# Altium schematic sheet DSO_Control.SchDoc: Schematic_Name
size A4; CompanyName: University of Melbourne; Engineer: Your Name Here; DocumentNumber: 1; Revision: 0.1; SheetNumber: 1; SheetTotal: 1; Title_Project: Project_Title; StudentNo: Student No.
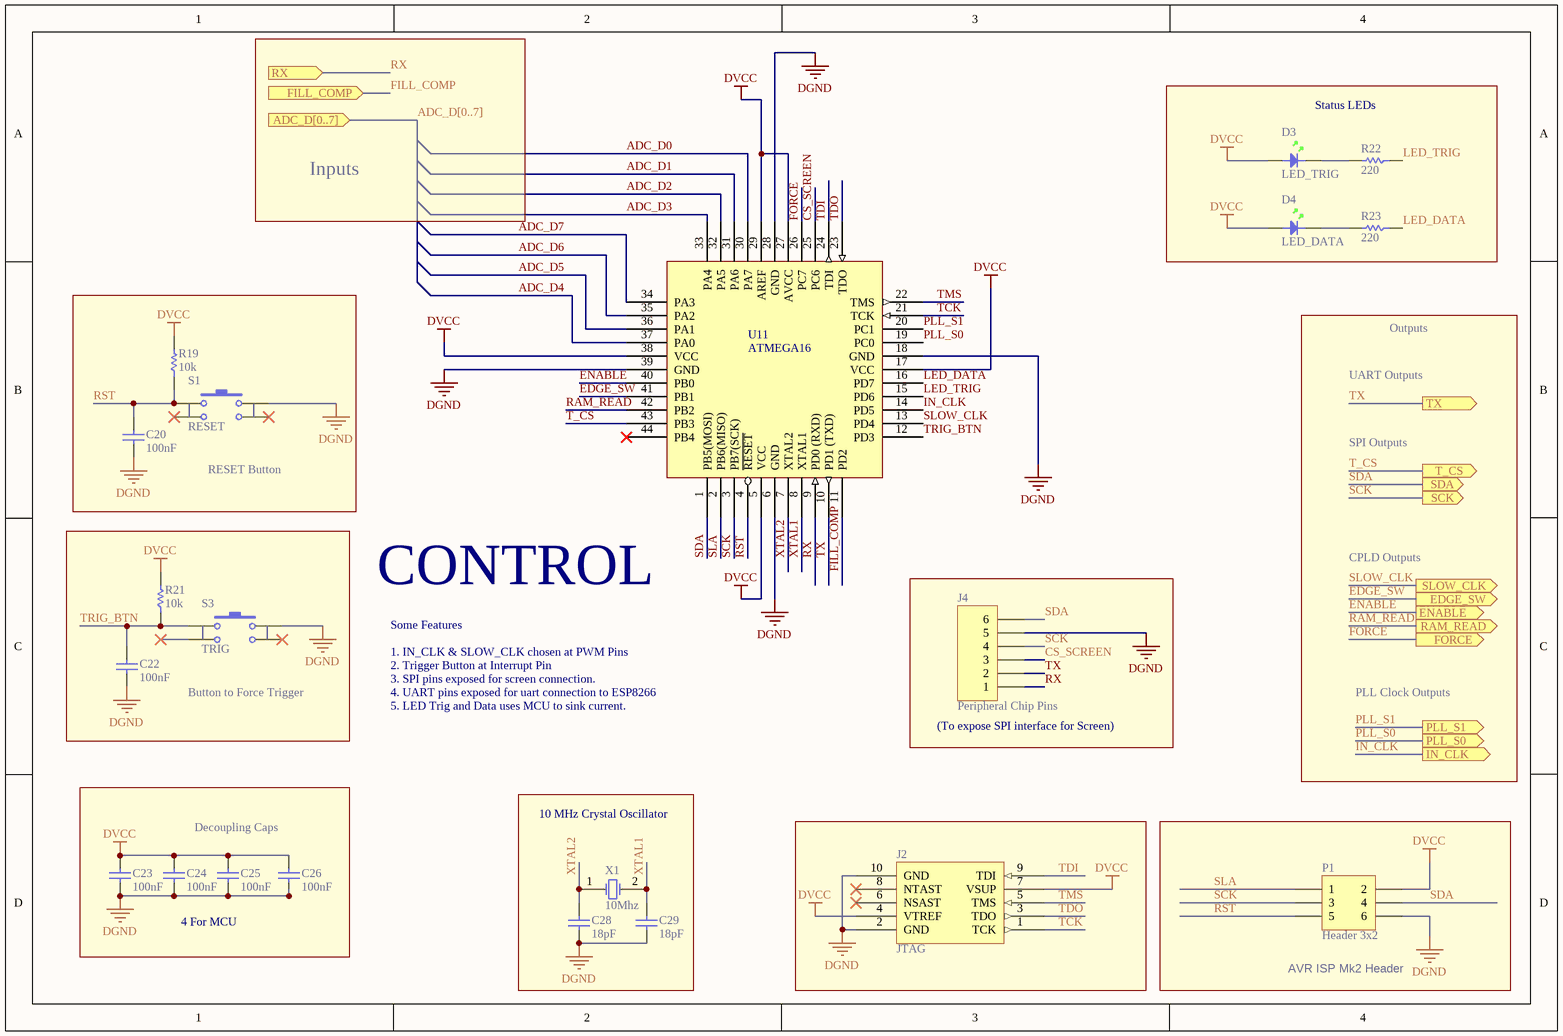
[diagram p0: DSO_Control.SchDoc]

## Parts
C20  100nF  [0805C]
C22  100nF  [0805C]
C23  100nF  [0805C]
C24  100nF  [0805C]
C25  100nF  [0805C]
C26  100nF  [0805C]
C28  18pF  [0805C]
C29  18pF  [0805C]
D3  LED_TRIG  [0805D-GREEN]
D4  LED_DATA  [0805D-GREEN]
J2  JTAG  [BOXEDVERT10]
J4  Peripheral Chip Pins  [HDR1X6]
P1  Header 3x2  [HDR3x2]
R19  10k  [0805]
R21  10k  [0805]
R22  220  [0805]
R23  220  [0805]
S1  RESET  [SPST PB SWITCH SMD]
S3  TRIG  [SPST PB SWITCH SMD]
U11  ATMEGA16  [QFP-48]
X1  10Mhz  [XTAL_FLAT_SMD]

## Blocks framed on the sheet
Status LEDs: D3 D4 R22 R23
RESET Button: C20 R19 S1
Button to Force Trigger: C22 R21 S3
(To expose SPI interface for Screen): J4
10 MHz Crystal Oscillator: C28 C29 X1
AVR ISP Mk2 Header: P1

## Ports
ADC_D[0..7] (in), EDGE_SW (out), ENABLE (out), FILL_COMP (in), FORCE (out), IN_CLK (out), PLL_S0 (out), PLL_S1 (out), RAM_READ (out), RX (in), SCK (out), SDA (out), SLOW_CLK (out), T_CS (out), TX (out)

## Nets
DGND: C20.2 C22.2 C23.2 C24.2 C25.2 C26.2 C28.2 C29.2 J2.2(GND) J2.10(GND) J4.5 P1.6 S1.2 S3.2 U11.6(GND) U11.18(GND) U11.28(GND) U11.39(GND)
DVCC: C23.1 C24.1 C25.1 C26.1 D3.A D4.A J2.4(VTREF) J2.7(VSUP) P1.2 R19.2 R21.2 U11.5(VCC) U11.17(VCC) U11.27(AVCC) U11.29(AREF) U11.38(VCC)
ADC_D0: U11.30(PA7)
ADC_D1: U11.31(PA6)
ADC_D2: U11.32(PA5)
ADC_D3: U11.33(PA4)
ADC_D4: U11.37(PA0)
ADC_D5: U11.36(PA1)
ADC_D6: U11.35(PA2)
ADC_D7: U11.34(PA3)
CS_SCREEN: J4.3 U11.25(PC6)
EDGE_SW: U11.41(PB1) ; port EDGE_SW
ENABLE: U11.40(PB0) ; port ENABLE
FILL_COMP: U11.11(PD2) ; port FILL_COMP
FORCE: U11.26(PC7) ; port FORCE
IN_CLK: U11.14(PD5) ; port IN_CLK
LED_DATA: R23.1 U11.16(PD7)
LED_TRIG: R22.1 U11.15(PD6)
PLL_S0: U11.19(PC0) ; port PLL_S0
PLL_S1: U11.20(PC1) ; port PLL_S1
RAM_READ: U11.42(PB2) ; port RAM_READ
RST: C20.1 P1.5 R19.1 S1.1 U11.4(~{RESET})
RX: J4.1 U11.9(PD0_(RXD)) ; port RX
SCK: J4.4 P1.3 U11.3(PB7(SCK)) ; port SCK
SDA: J4.6 P1.4 U11.1(PB5(MOSI)) ; port SDA
SLA: P1.1 U11.2(PB6(MISO))
SLOW_CLK: U11.13(PD4) ; port SLOW_CLK
T_CS: U11.43(PB3) ; port T_CS
TCK: J2.1(TCK) U11.21(TCK)
TDI: J2.9(TDI) U11.24(TDI)
TDO: J2.3(TDO) U11.23(TDO)
TMS: J2.5(TMS) U11.22(TMS)
TRIG_BTN: C22.1 R21.1 S3.1 U11.12(PD3)
TX: J4.2 U11.10(PD1_(TXD)) ; port TX
XTAL1: C29.1 U11.8(XTAL1) X1.2(OSC2)
XTAL2: C28.1 U11.7(XTAL2) X1.1(OSC1)
NetD3_K: D3.K R22.2
NetD4_K: D4.K R23.2

Not connected (* = marked no-connect by the designer): J2 6(NSAST)* 8(NTAST)*; S1 3* 4*; S3 3* 4*; U11 44(PB4)*

## Buses and harness runs
bus ADC_D[0..7] = port ADC_D[0..7]

## Notes on the sheet
- Inputs
- UART Outputs
- Outputs
- SPI Outputs
- CPLD Outputs
- CONTROL
- 1. IN_CLK & SLOW_CLK chosen at PWM Pins
- Some Features
- 2. Trigger Button at Interrupt Pin
- 3. SPI pins exposed for screen connection.
- 4. UART pins exposed for uart connection to ESP8266
- 5. LED Trig and Data uses MCU to sink current.
- PLL Clock Outputs
- Decoupling Caps
- 4 For MCU

## Library data of the parts
C20 C22-C26 C28 C29 = C: Capacitor; Reviewed by: RM - 2018/08/05; Revision: July-2002: Re-released for DXP Platform.; Supplier 1: *; Supplier Part Number 1: *
  C20 C22-C26: Value: 100nF
  C28 C29: Value: 18pF
D3 D4 = LED GREEN: Light Emitting Diode; Reviewed by: RM - 2018/08/05; Revision: July-2002: Re-released for DXP Platform.; Supplier 1: Digi-Key; Supplier Part Number 1: 160-1423-1-ND
J2 = JTAG_CON: Reviewed by: RM - 2018/08/05; Supplier 1: Digi-Key; Supplier Part Number 1: OR896-ND
J4 = Header 6: Header, 6-Pin
P1 = Header 3x2: Header, 5-Pin; Reviewed by: RM - 2018/08/05; Supplier 1: Digi-Key; Supplier Part Number 1: 952-2121-ND
R19 R21-R23 = R: Resistor; Reviewed by: RM - 2018/08/05; Supplier 1: *; Suppler Part Number 1: *
  R19 R21: Value: 10k
  R22 R23: Value: 220
S1 S3 = SW_PB_1P1T4: Momentary Push Button Switch 1P 1T 2pins; Reviewed by: RM - 2018/08/05; Revision: July-2002: Re-released for DXP Platform.; Supplier 1: Digi-Key; Supplier Part Number 1: CKN9085CT-ND
U11 = ATMEGA16: ATMEGA16 Microcontroller; Reviewed by: RM - 2018/08/05; Supplier 1: Digi-Key; Supplier Part Number 1: ATMEGA16A-AU-ND
X1 = XTAL: Crystal Oscillator; Reviewed by: RM - 2018/08/05; Revision: July-2002: Re-released for DXP Platform.; Supplier 1: Digi-Key; Supplier Part Number 1: 887-1080-1-ND